# Altium schematic sheet v1.1.SchDoc
size 101 x 86 mm
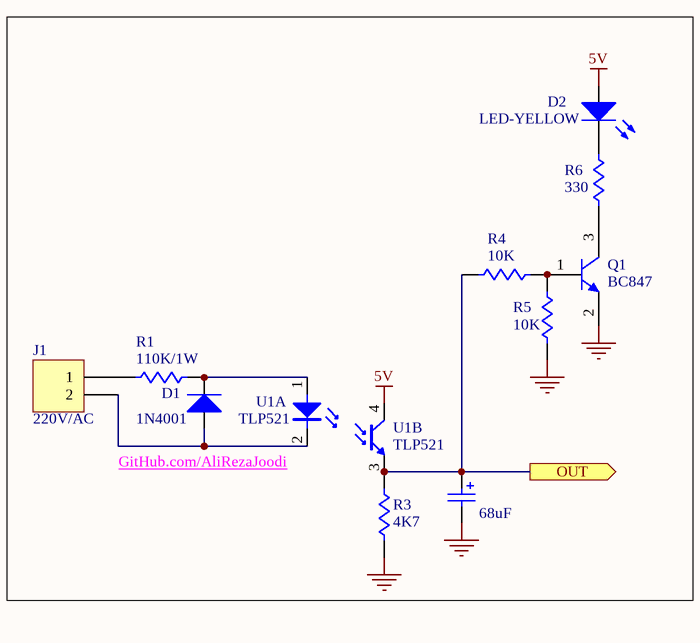
[diagram p0: v1.1.SchDoc]

## Parts
C1  value 68uF  [Cap_D]  (hidden comment: CAP)
D1  1N4001  [MELF-D3516-1406]
D2  LED-YELLOW  [0805_Diode]
J1  J9  [Fonics_2PIN_1]  (value not drawn)
Q1  BC847  [SOT23-3N]
R1  110K/1W  [0805]
R3  4K7  [0805]
R4  10K  [0805]
R5  10K  [0805]
R6  330  [0805]
U1  TLP521  [SMD_4PIN]  (parts A,B of 2)

## Ports
OUT (out)

## Nets
5V: D2.1(A) U1.4(C)
GND: C1.2 Q1.2(E) R3.2 R5.1
OUT: C1.1 R3.1 R4.1 U1.3(E) ; port OUT
NetD1_1: D1.1(A) J1.2 U1.2(K)
NetD1_2: D1.2(K) R1.2 U1.1(A)
NetD2_2: D2.2(K) R6.1
NetJ1_1: J1.1 R1.1
NetQ1_1: Q1.1(B) R4.2 R5.2
NetQ1_3: Q1.3(C) R6.2

## Notes on the sheet
- (near J1) 220V/AC
- GitHub.com/AliRezaJoodi

## Library data of the parts
C1 = Cap Pol1: Polarized Capacitor (Radial); Manufacturer: Generic Components; Class I: Passive; Published: 8-Jun-2000; Revision: July-2002: Re-released for DXP Platform.; Publisher: Altium Limited; Class II: Capacitor
D1 = Diode: Default Diode; Manufacturer: Generic Components; Class I: Discrete; Class II: Diode - Switching; Published: 8-Jun-2000; Revision: July-2002: Re-released for DXP Platform.; Publisher: Altium Limited; Value: 1N4001
D2 = LED: Typical INFRARED GaAs LED; Manufacturer: Generic Components; Class I: Optoelectronic; Published: 8-Jun-2000; Revision: July-2002: Re-released for DXP Platform.; Publisher: Altium Limited; Class II: LED
J1 = Header 2: Header, 2-Pin; LatestRevisionDate: 17-Jul-2002; LatestRevisionNote: Re-released for DXP Platform.; Publisher: Altium Limited
Q1 = BC847: Silicon Bipolar Transistor
R1 R3-R6 = Res1: Resistor; Manufacturer: Generic Components; Class I: Passive; Published: 8-Jun-2000; Revision: July-2002: Re-released for DXP Platform.; Publisher: Altium Limited; Class II: Resistor
U1 = Optoisolator: Publisher: Altium Limited